# EasyEDA Pro project 一体板.epro, board PCB4
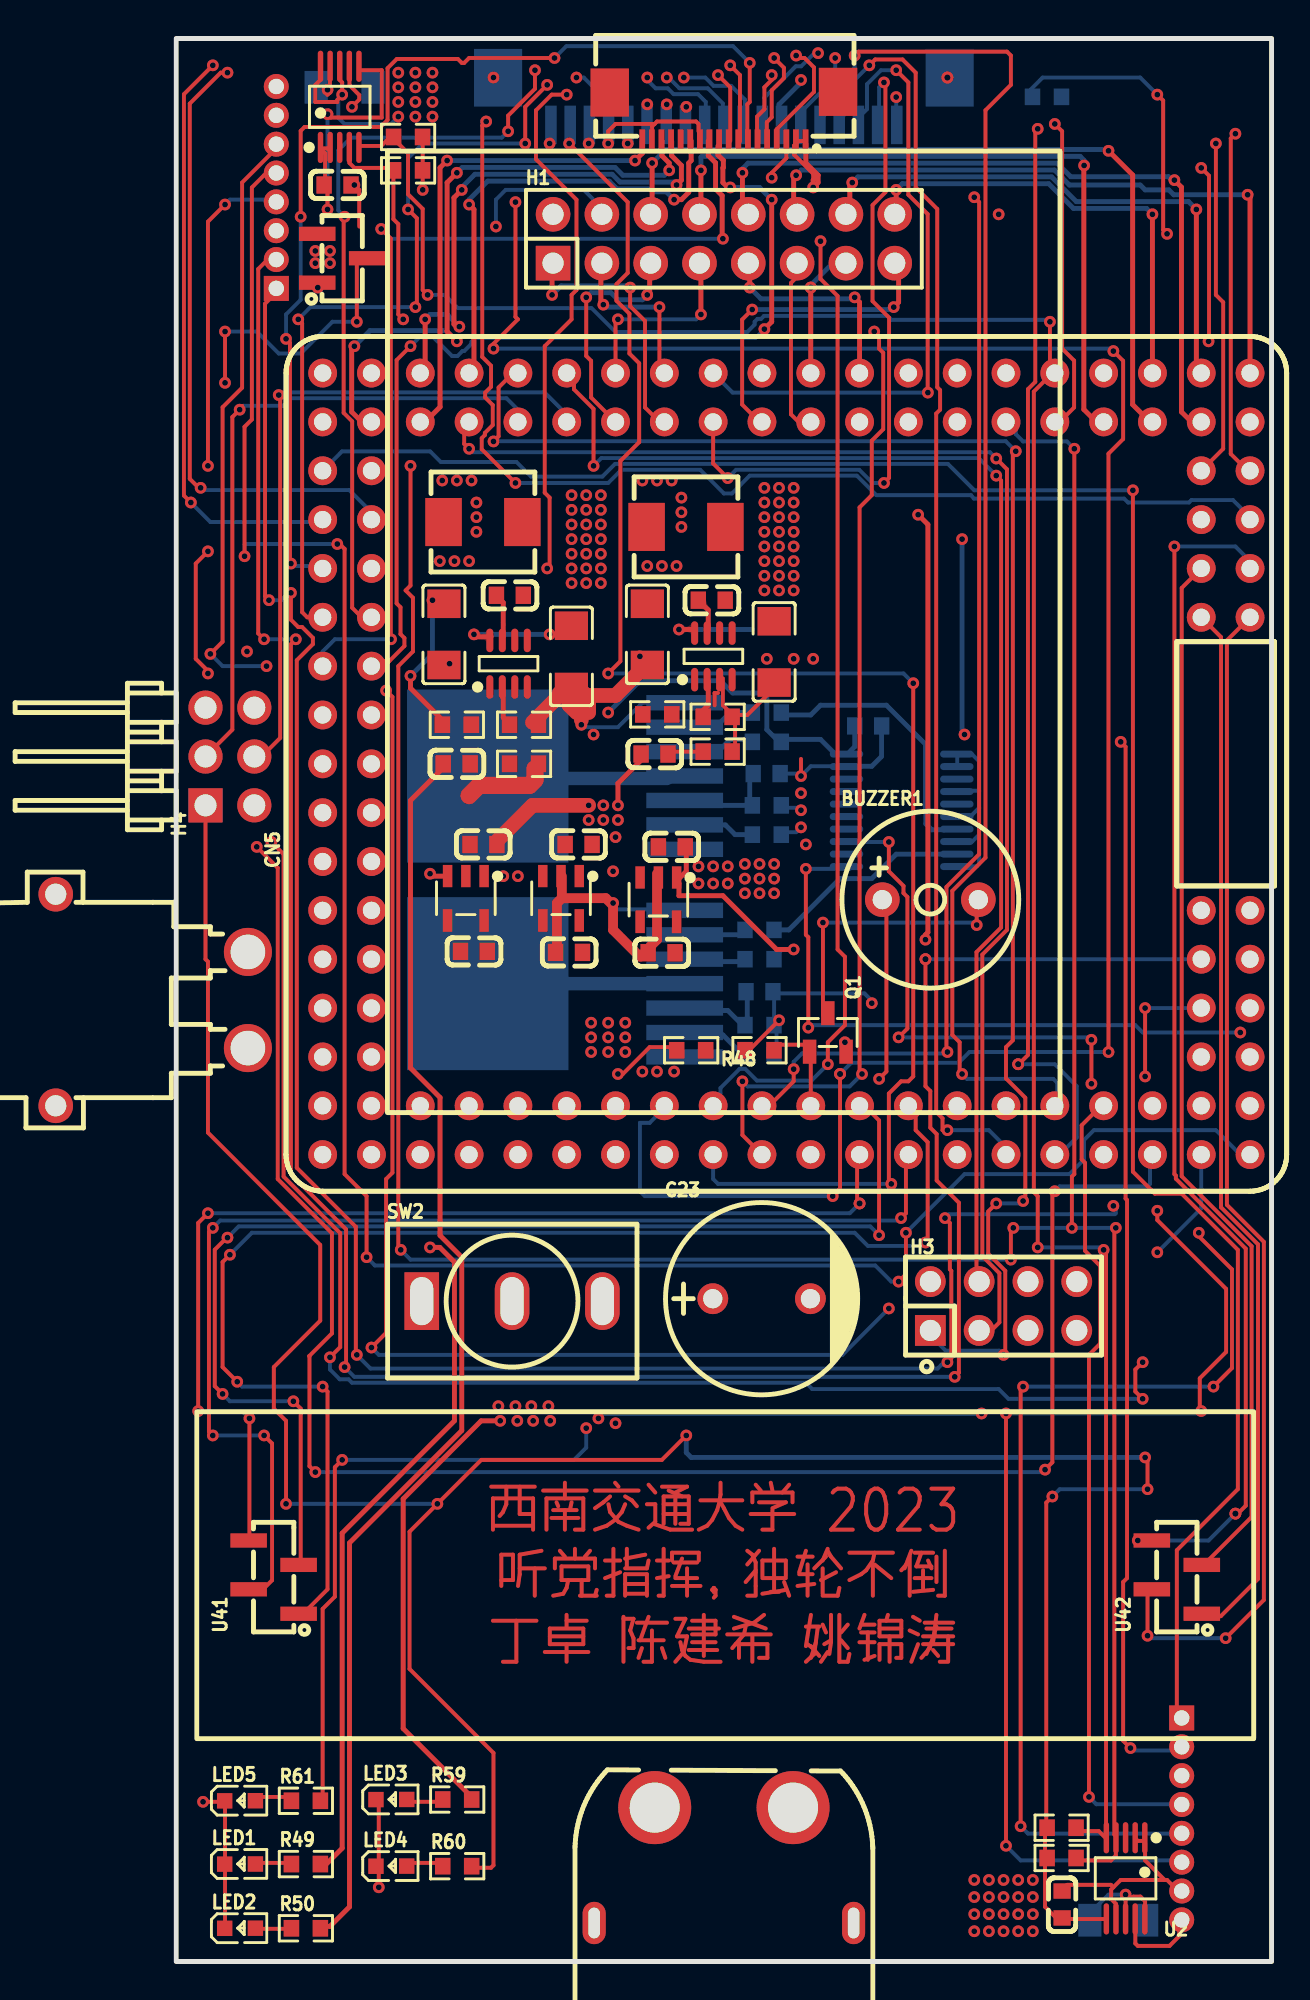
[diagram p11: board, top side]
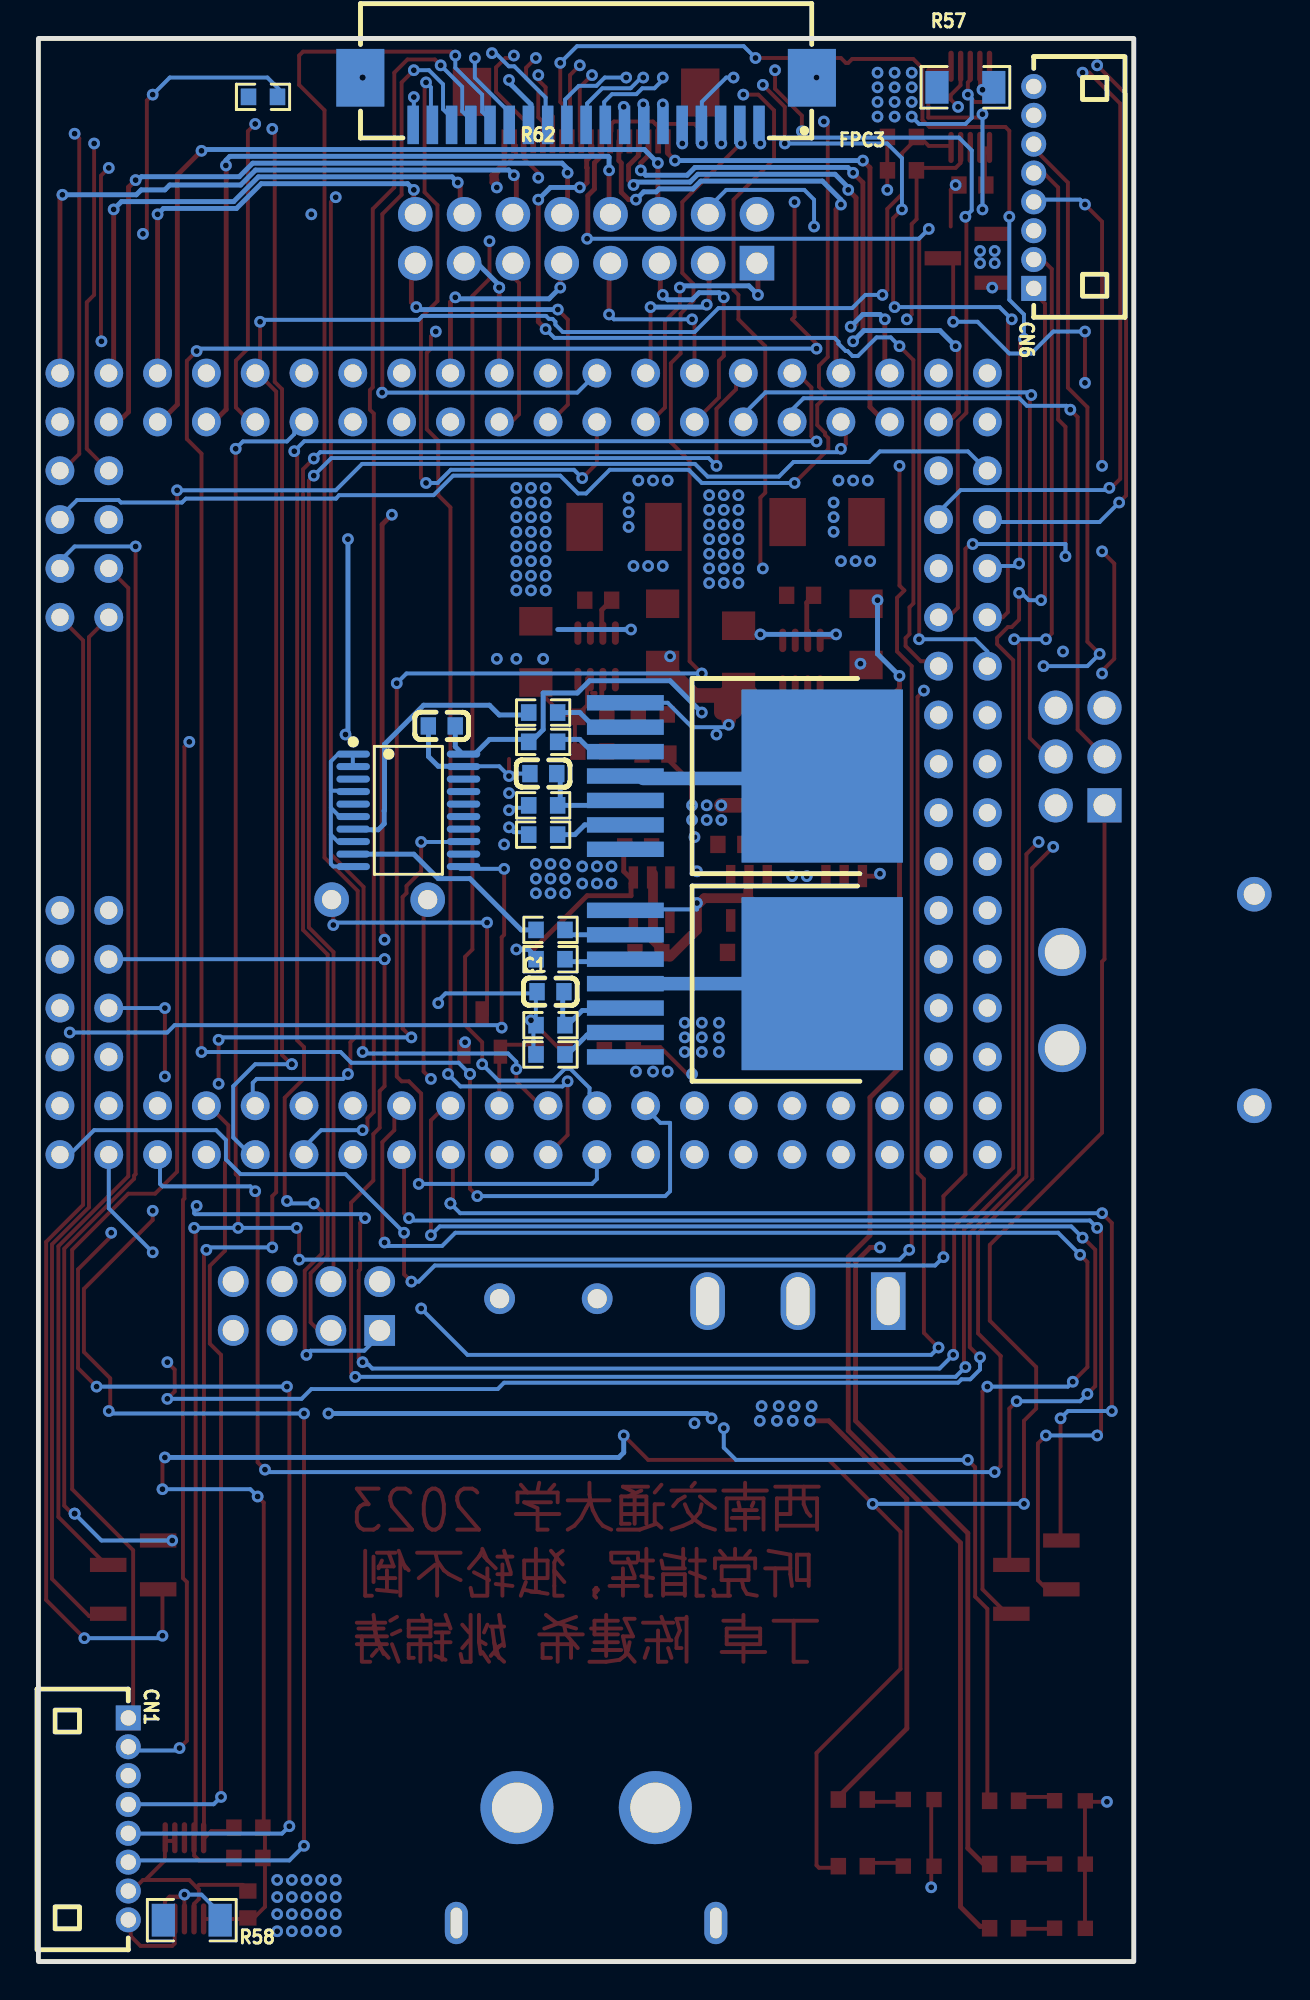
[diagram p12: board, bottom side, seen from below]

Outline 57 x 100 mm; copper layers: Top Layer, Inner1, Inner2, Bottom Layer. Coordinates in mm from the lower left corner of the outline.
Outline path: rectangle 0,100 57,0
Stack: Top Layer 0.035mm 外层铜厚1oz / Dielectric1 0.2104mm 7628 RC49% 8.6mil / Inner1 0.0152mm 内层铜厚 / Dielectric2 1.065mm 1.1mm H/HOZ 含铜 / Inner2 0.0152mm 内层铜厚 / Dielectric3 0.2104mm 7628 RC49% 8.6mil / Bottom Layer 0.035mm 外层铜厚1oz

## Design rules (mm)
template: 自定义配置
spacing copperThickness1oz (default): track to track 0.102, other pairs 0.152 to 0.3
spacing copperThickness2oz: track to track 0.203, other pairs 0.152 to 0.3
track width copperThickness1oz (default): min 0.127, default 0.254, max 2.54
track width copperThickness2oz: min 0.203, default 0.254, max 2.54
differential pair differentialPair (default): width min 0.127, default 0.254, max 2.54; gap min 0.152, default 0.152
via viaSize (default): diameter min 0.5, default 0.61, max 10; hole min 0.3, default 0.305, max 6.3

## Placement (name value [footprint] x y rotation side)
BUZZER1  3kHz  [BUZ-TH_BD9.0-P5.00-D0.6-FD]  39.24 55.22 0 top
C1  100nF  [C0603]  30.35 50.43 180 bottom
C2  100nF  [C0603]  30.73 61.77 180 bottom
C3  100nF  [C0603]  36.01 64.25 180 bottom
C7  1uF  [C0603]  15.99 58.09 0 top
C8  4.7uF  [C1206]  31.12 68.1 90 top
C9  12pF  [C0603]  24.89 62.79 180 top
C10  22uF  [C1206]  24.52 69.01 90 top
C11  10nF  [C0603]  27.87 70.79 180 top
C12  4.7uF  [C1206]  20.56 67.87 90 top
C13  12pF  [C0603]  14.6 62.28 180 top
C14  22uF  [C1206]  13.93 69.01 90 top
C15  10nF  [C0603]  17.36 71.04 180 top
C16  1uF  [C0603]  15.49 52.53 180 top
C17  1uF  [C0603]  25.79 57.96 0 top
C18  1uF  [C0603]  25.26 52.46 180 top
C19  1uF  [C0603]  20.94 58.09 0 top
C20  1uF  [C0603]  20.44 52.48 180 top
C21  100nF  [C0603]  46.1 2.97 90 top
C22  100nF  [C0603]  8.4 92.38 0 top
C23  220uF  [CAP-TH_BD10.0-P5.00-D1.0-FD]  30.46 34.47 0 top
CN1  HC-ZH1.5-8AW  [CONN-TH_8P-P1.50_HCTL_HC-ZH1.5-8AW]  52.32 7.42 270 bottom
CN5  XT30PW-M  [CONN-TH_XT30PW-M]  -1.27 50 270 top
CN6  HC-ZH1.5-8AW  [CONN-TH_8P-P1.50_HCTL_HC-ZH1.5-8AW]  5.21 92.25 90 bottom
CN8  -  [CONN-TH_XT60PW-M]  28.5 5 90 top
FPC3  X10B25L19T  [FPC-SMD_X10B25U19T]  28.5 96.73 0 bottom
FPC4  FPC-05F-18PH20  [FPC-SMD_18P-P0.50_FPC-05F-18PH20]  28.5 95.94 180 top
H1  2.54-2*8P母加长针3.8  [HDR-TH_16P-P2.54-V-F-R2-C8-S2.54-1]  28.5 89.59 0 top
H3  DS1023-2*4SF11  [HDR-TH_8P-P2.54-V-F-R2-C4-S2.54-1]  43.05 34.09 0 top
H4  A2541WR-2x3P  [HDR-TH_6P-P2.54-H-R2-C3-S2.54-W10.0_A2541WR]  2.79 62.66 90 top
L2  4.7uH  [IND-SMD_L5.4-W5.2_FXL0530]  26.53 74.6 180 top
L3  4.7uH  [IND-SMD_L5.4-W5.2_FXL0530]  15.96 74.85 180 top
LED1  KT-0603R  [LED0603-RD]  3.32 5.07 0 top
LED2  KT-0603R  [LED0603-RD]  3.32 1.73 0 top
LED3  KT-0603R  [LED0603-RD]  11.19 8.42 0 top
LED4  KT-0603R  [LED0603-RD]  11.19 4.96 0 top
LED5  KT-0603R  [LED0603-RD]  3.32 8.36 0 top
Q1  S9013-G  [SOT-23-3_L2.9-W1.3-P1.90-LS2.4-BR]  33.91 48.31 270 top
R1  10kΩ  [R0603]  30.35 53.64 0 bottom
R3  1kΩ  [R0603]  30.73 58.6 0 bottom
R4  0603WAF5100T5E  [R0603]  30.73 60.12 0 bottom
R5  10kΩ  [R0603]  30.73 63.42 0 bottom
R6  10kΩ  [R0603]  30.73 64.95 0 bottom
R28  10kΩ  [R0603]  30.35 47.39 180 top
R37  1kΩ  [R0603]  30.35 47.17 0 bottom
R38  0603WAF5100T5E  [R0603]  30.35 48.69 0 bottom
R39  10kΩ  [R0603]  30.35 52.12 0 bottom
R41  47kΩ  [R0603]  28.17 64.72 180 top
R42  15kΩ  [R0603]  28.17 62.92 180 top
R43  110kΩ  [R0603]  25.03 64.85 180 top
R45  47kΩ  [R0603]  18.1 64.31 180 top
R47  110kΩ  [R0603]  14.6 64.31 180 top
R48  10kΩ  [R0603]  26.8 47.39 180 top
R49  1kΩ  [R0603]  6.75 5.07 0 top
R50  1kΩ  [R0603]  6.75 1.73 0 top
R51  4.7kΩ  [R0603]  46.07 5.38 0 top
R52  4.7kΩ  [R0603]  46.07 6.96 0 top
R54  4.7kΩ  [R0603]  12.06 93.14 180 top
R55  4.7kΩ  [R0603]  12.06 94.88 180 top
R56  12kΩ  [R0603]  18.1 62.28 180 top
R57  16mΩ  [R1206]  8.76 97.46 180 bottom
R58  16mΩ  [R1206]  49.02 2.15 0 bottom
R59  1kΩ  [R0603]  14.62 8.42 0 top
R60  1kΩ  [R0603]  14.62 4.96 0 top
R61  1kΩ  [R0603]  6.75 8.36 0 top
R62  0Ω  [R0603]  45.31 96.96 0 bottom
SW2  MT-0-103-A101-M200-RS+PJ  [SW-TH_MT-0-103-A101-M200-RS]  17.48 34.34 0 top
U1  TC387核心板 COPY  [TC264逐飞]  26.67 62.92 90 top
U2  INA226AIDGSR  [MSOP-10_L3.0-W3.0-P0.50-LS5.0-BL]  49.4 4.33 180 top
U29  SN74HC244PWR  [TSSOP-20_L6.5-W4.4-P0.65-LS6.4-BL]  37.75 59.86 270 bottom
U30  BTN8982TA  [TO-263-7_L10.2-W10.4-P1.27-LS14.4-TL]  21.34 50.85 180 bottom
U31  BTN8982TA  [TO-263-7_L10.2-W10.4-P1.27-LS14.4-TL]  21.34 61.65 180 bottom
U35  SY8303AIC  [TSOT-23-8_L2.9-W1.6-P0.65-LS2.8-BR]  27.95 67.87 270 top
U36  SY8303AIC  [TSOT-23-8_L2.9-W1.6-P0.65-LS2.8-BR]  17.29 67.49 270 top
U37  RT9013-33GB  [SOT-23-5_L3.0-W1.7-P0.95-LS2.8-BL]  15.07 55.29 180 top
U38  RT9013-33GB  [SOT-23-5_L3.0-W1.7-P0.95-LS2.8-BL]  25.09 55.22 180 top
U39  RT9013-33GB  [SOT-23-5_L3.0-W1.7-P0.95-LS2.8-BL]  20.02 55.29 180 top
U40  INA226AIDGSR  [MSOP-10_L3.0-W3.0-P0.50-LS5.0-BL]  8.51 96.44 0 top
U41  X1311FVS-04-C43D35R2  [HDR-SMD_4P-P1.27-V-F-LS4.5_R2]  5.07 19.99 90 top
U42  X1311FVS-04-C43D35R2  [HDR-SMD_4P-P1.27-V-F-LS4.5_R2]  52.07 19.99 90 top
U44  X1311FVS-03-C43D35R1  [HDR-SMD_3P-P1.27-V-F_R1]  8.64 88.57 90 top

## Footprints (pads in the part's own frame, mm; a bottom-side part is the same pattern mirrored in y, then rotated)
BUZ-TH_BD9.0-P5.00-D0.6-FD
  round 1.801 hole 1.001: 1(-2.499,0) 2(2.499,0)
C0603
  rect 0.8x0.9 smd: 1(-0.7,0) 2(0.7,0)
C1206
  rect 1.485x1.728 smd: 1(-1.593,0) 2(1.593,0)
CAP-TH_BD10.0-P5.00-D1.0-FD
  round 1.6 hole 1: 1(-2.54,0) 2(2.54,0)
CONN-TH_8P-P1.50_HCTL_HC-ZH1.5-8AW
  rect 1.3x1.3 hole 0.8: 1(-5.25,0)
  round 1.3 hole 0.8: 2(-3.75,0) 3(-2.25,0) 4(-0.75,0) 5(0.75,0) 6(2.25,0) 7(3.75,0) 8(5.25,0)
CONN-TH_XT30PW-M
  round 2.5 hole 1.8: 1(-2.5,5) 2(2.5,5)
  round 1.8 hole 1.1: 3(5.5,-5) 4(-5.5,-5)
CONN-TH_XT60PW-M
  round 3.8 hole 2.6: 1(3,-3.6) 2(3,3.6)
  oval 2.2x1.2 hole 1.6x0.6: 3(-3,6.75) 4(-3,-6.75)
FPC-SMD_18P-P0.50_FPC-05F-18PH20
  rect 0.3x1.25 smd: 1(-4.25,1.288) 2(-3.75,1.288) 3(-3.25,1.288) 4(-2.75,1.288) 5(-2.25,1.288) 6(-1.75,1.288) 7(-1.25,1.288) 8(-0.75,1.288) 9(-0.25,1.288) 10(0.25,1.288) 11(0.75,1.288) 12(1.25,1.288) 13(1.75,1.288) 14(2.25,1.288) 15(2.75,1.288) 16(3.25,1.288) 17(3.75,1.288) 18(4.25,1.288)
  rect 2x2.5 smd: 19(-5.94,-1.288) 20(5.94,-1.252)
FPC-SMD_X10B25U19T
  rect 0.6x2 smd: 1(-9,1.225) 2(-8,1.225) 3(-7,1.225) 4(-6,1.225) 5(-5,1.225) 6(-4,1.225) 7(-3,1.225) 8(-2,1.225) 9(-1,1.225) 10(0,1.225) 11(1,1.225) 12(2,1.225) 13(3,1.225) 14(4,1.225) 15(5,1.225) 16(6,1.225) 17(7,1.225) 18(8,1.225) 19(9,1.225)
  rect 2.5x3 smd: 20(11.75,-1.225) 21(-11.75,-1.225)
HDR-SMD_3P-P1.27-V-F_R1
  rect 0.74x1.9 smd: 1(-1.27,1.3) 2(0,-1.3) 3(1.27,1.3)
HDR-SMD_4P-P1.27-V-F-LS4.5_R2
  rect 0.74x1.9 smd: 1(-1.905,-1.3) 2(-0.635,1.3) 3(0.635,-1.3) 4(1.905,1.3)
HDR-TH_6P-P2.54-H-R2-C3-S2.54-W10.0_A2541WR
  rect 1.778x1.778 hole 1.143: 1(-2.54,1.27)
  round 1.778 hole 1.143: 2(-2.54,-1.27) 3(0,1.27) 4(0,-1.27) 5(2.54,1.27) 6(2.54,-1.27)
HDR-TH_8P-P2.54-V-F-R2-C4-S2.54-1
  rect 1.6x1.6 hole 1.1: 1(-3.81,-1.27)
  round 1.6 hole 1.1: 2(-3.81,1.27) 3(-1.27,-1.27) 4(-1.27,1.27) 5(1.27,-1.27) 6(1.27,1.27) 7(3.81,-1.27) 8(3.81,1.27)
HDR-TH_16P-P2.54-V-F-R2-C8-S2.54-1
  rect 1.8x1.8 hole 1.1: 1(-8.89,-1.27)
  round 1.8 hole 1.1: 2(-8.89,1.27) 3(-6.35,-1.27) 4(-6.35,1.27) 5(-3.81,-1.27) 6(-3.81,1.27) 7(-1.27,-1.27) 8(-1.27,1.27) 9(1.27,-1.27) 10(1.27,1.27) 11(3.81,-1.27) 12(3.81,1.27) 13(6.35,-1.27) 14(6.35,1.27) 15(8.89,-1.27) 16(8.89,1.27)
IND-SMD_L5.4-W5.2_FXL0530
  rect 1.9x2.5 smd: 1(-2.05,0) 2(2.05,0)
LED0603-RD
  rect 0.8x0.8 smd: 1(-0.799,-0.004) 2(0.799,0.004)
MSOP-10_L3.0-W3.0-P0.50-LS5.0-BL
  oval 0.28x1.62 smd: 1(-1,-2.11) 2(-0.5,-2.11) 3(0,-2.11) 4(0.5,-2.11) 5(1,-2.11) 6(1,2.11) 7(0.5,2.11) 8(0,2.11) 9(-0.5,2.11) 10(-1,2.11)
R0603
  rect 0.806x0.864 smd: 1(-0.753,0) 2(0.753,0)
R1206
  rect 1.208x1.701 smd: 1(-1.479,0) 2(1.479,0)
SOT-23-3_L2.9-W1.3-P1.90-LS2.4-BR
  rect 1.25x0.7 smd: 1(1,-0.95) 2(1,0.95) 3(-1,0)
SOT-23-5_L3.0-W1.7-P0.95-LS2.8-BL
  rect 0.49x1.157 smd: 1(-0.95,-1.153) 2(0,-1.153) 3(0.95,-1.153)
  rect 0.49x1.175 smd: 4(0.95,1.153) 5(-0.95,1.153)
SW-TH_MT-0-103-A101-M200-RS
  rect 1.8x3 hole 1.2x2.5: 1(-4.7,0)
  oval 1.8x3 hole 1.2x2.5: 2(0,0) 3(4.7,0)
TC264逐飞
  round 1.5 hole 0.9: 1(-20.955,19.05) 2(-18.415,19.05) 3(-20.955,16.51) 4(-18.415,16.51) 5(-20.955,13.97) 6(-18.415,13.97) 7(-20.955,11.43) 8(-18.415,11.43) 9(-20.955,8.89) 10(-18.415,8.89) 11(-20.955,6.35) 12(-18.415,6.35) 13(-20.955,3.81) 14(-18.415,3.81) 15(-20.955,1.27) 16(-18.415,1.27) 17(-20.955,-1.27) 18(-18.415,-1.27) 19(-20.955,-3.81) 20(-18.415,-3.81) 21(-20.955,-6.35) 22(-18.415,-6.35) 23(-20.955,-8.89) 24(-18.415,-8.89) 25(-20.955,-11.43) 26(-18.415,-11.43) 27(-20.955,-13.97) 28(-18.415,-13.97) 29(-20.955,-16.51) 30(-18.415,-16.51) 31(-20.955,-19.05) 32(-18.415,-19.05) 33(-20.955,-21.59) 34(-18.415,-21.59) 35(-20.955,-24.13) 36(-18.415,-24.13) 37(-20.955,-26.67) 38(-18.415,-26.67) 39(-20.955,-29.21) 40(-18.415,-29.21) 41(-15.875,-29.21) 42(-15.875,-26.67) 43(-13.335,-29.21) 44(-13.335,-26.67) 45(-10.795,-29.21) 46(-10.795,-26.67) 47(-8.255,-29.21) 48(-8.255,-26.67) 49(6.985,-26.67) 50(6.985,-29.21) 51(9.525,-26.67) 52(9.525,-29.21) 53(12.065,-26.67) 54(12.065,-29.21) 55(14.605,-26.67) 56(14.605,-29.21) 57(17.145,-29.21) 58(19.685,-29.21) 59(17.145,-26.67) 60(19.685,-26.67) 61(17.145,-24.13) 62(19.685,-24.13) 63(17.145,-21.59) 64(19.685,-21.59) 65(17.145,-19.05) 66(19.685,-19.05) 67(17.145,-16.51) 68(19.685,-16.51) 69(17.145,-13.97) 70(19.685,-13.97) 71(17.145,-11.43) 72(19.685,-11.43) 73(17.145,-8.89) 74(19.685,-8.89) 75(17.145,-6.35) 76(19.685,-6.35) 77(17.145,-3.81) 78(19.685,-3.81) 79(17.145,-1.27) 80(19.685,-1.27) 81(17.145,1.27) 82(19.685,1.27) 83(17.145,3.81) 84(19.685,3.81) 85(17.145,6.35) 86(19.685,6.35) 87(17.145,8.89) 88(19.685,8.89) 89(17.145,11.43) 90(19.685,11.43) 91(17.145,13.97) 92(19.685,13.97) 93(17.145,16.51) 94(19.685,16.51) 95(17.145,19.05) 96(19.685,19.05) 97(14.605,16.51) 98(14.605,19.05) 99(12.065,16.51) 100(12.065,19.05) 101(9.525,16.51) 102(9.525,19.05) 103(6.985,16.51) 104(6.985,19.05) 105(4.445,16.51) 106(4.445,19.05) 107(1.905,16.51) 108(1.905,19.05) 109(-0.635,16.51) 110(-0.635,19.05) 111(-3.175,16.51) 112(-3.175,19.05) 113(-5.715,16.51) 114(-5.715,19.05) 115(-8.255,16.51) 116(-8.255,19.05) 117(-10.795,16.51) 118(-10.795,19.05) 119(-13.335,16.51) 120(-13.335,19.05) 121(-15.875,16.51) 122(-15.875,19.05)
TO-263-7_L10.2-W10.4-P1.27-LS14.4-TL
  rect 4x0.8 smd: 1(-5.122,3.81) 2(-5.122,2.54) 3(-5.122,1.27) 4(-5.122,0) 5(-5.122,-1.27) 6(-5.122,-2.54) 7(-5.122,-3.81)
  rect 8.4x9 smd: 8(5.122,0)
TSOT-23-8_L2.9-W1.6-P0.65-LS2.8-BR
  oval 1.222x0.364 smd: 1(1.211,-0.975) 2(1.211,-0.325) 3(1.211,0.325) 4(1.211,0.975) 5(-1.211,0.975) 6(-1.211,0.325) 7(-1.211,-0.325) 8(-1.211,-0.975)
TSSOP-20_L6.5-W4.4-P0.65-LS6.4-BL
  oval 0.364x1.742 smd: 1(-2.925,-2.871) 2(-2.275,-2.871) 3(-1.625,-2.871) 4(-0.975,-2.871) 5(-0.325,-2.871) 6(0.325,-2.871) 7(0.975,-2.871) 8(1.625,-2.871) 9(2.275,-2.871) 10(2.925,-2.871) 11(2.925,2.871) 12(2.275,2.871) 13(1.625,2.871) 14(0.975,2.871) 15(0.325,2.871) 16(-0.325,2.871) 17(-0.975,2.871) 18(-1.625,2.871) 19(-2.275,2.871) 20(-2.925,2.871)

## Nets
As in the schematic.

Pads without a net: CN5 3 4; FPC4 14 19 20; H3 2 8; H4 5 6; U1 5 6 7 8 9 10 11 12 13 14 15 21 27 30 41 42 43 45 47 48 53 64 68 69 70 71 72 73 78 94 95 96 97 107 109 110 111 112 113 114 115 116 117 118 119 120 121 122; U2 3; U29 3 5 12 14 15 16 17 18; U37 4; U38 4; U39 4; U40 3

## Via types
v1: diameter 0.61, hole 0.305, Top Layer to Bottom Layer, 442 vias

## Routing (per net, layer and track width the routed paths; a pad name or vN(x,y) marks a point on that pad's centre or on a via; arc(x,y) is an arc through that point)
3.3V_LDO_CAMERA: length 122.6
  Top Layer w0.203: 32.38,94.67 32.15,94.44 32.15,93.96 33.15,92.96 33.15,92.63 ; 32.38,94.67 32.26,94.67 ; 32.38,94.67 32.77,94.67
  Top Layer w0.254: v1(16.86,28.12) 15.87,28.12 11.81,24.06 11.81,12.12 15.37,8.56 ; 32.77,94.54 32.77,93.52 33.4,92.89 ; 33.4,92.89 33.4,92.51 v1(33.15,92.25) 33.15,92.63 33.4,92.89 ; v1(38.61,75.23) 39.12,74.73 39.12,53.52 38.99,53.39 38.99,53.26 38.86,53.14 v1(38.99,53.14)
  Inner1 w0.254: v1(38.61,75.23) 38.61,75.74 39.24,76.38 39.24,80.31 39.75,80.82 39.75,81.84 39.5,82.09 39.5,82.83 36.43,85.9 36.07,85.9 36.07,89.2 35.69,89.59 34.42,89.59 33.81,90.2 33.53,90.2 33.53,91.87 v1(33.15,92.25)
  Inner2 w0.254: v1(16.76,28.88) 16.26,29.39 16.26,35.61 16.51,35.86 16.51,44.25 16.38,44.37 16.38,53.77 16.89,54.28 29.59,54.28 30.48,53.39 38.74,53.39 v1(38.99,53.14)
  vias: v1(17.65,28.88) v1(17.75,28.12) v1(18.48,28.88) v1(18.57,28.12) v1(19.37,28.88) v1(19.46,28.12)
3.3V_LDO_ELE: length 134.7
  Top Layer w0.203: 7.62,8.31 7.62,18.34 8.25,18.97 8.25,25.71 v1(8.64,26.09)
  Inner1 w0.254: v1(41.02,63.81) 40.39,63.17 40.39,51.23 41.91,49.71 41.91,38.02 40.64,36.75 40.64,31.8 41.91,30.53 v1(41.91,28.5) ; v1(42.8,90.86) 42.8,84 42.04,83.24 42.04,75.11 v1(40.89,73.97)
  Inner2 w0.254: v1(32.51,97.84) 35.31,97.84 37.08,96.06 40.89,96.06 42.8,94.16 v1(42.8,90.86)
  Bottom Layer w0.203: v1(8.64,26.09) 20.7,26.09 21.34,26.72 v1(21.34,27.74)
  Bottom Layer w0.254: v1(32.51,97.84) 32.38,97.71 32.38,97.59 31.37,96.57 31.37,96.06 ; v1(41.91,28.5) 22.22,28.5 v1(21.97,28.25) ; v1(41.02,63.81) 40.89,63.93 v1(40.89,73.97)
  vias: v1(22.86,27.99)
3.3V_LDO_ENCODER: length 273.4
  Top Layer w0.203: 9.53,98.35 10.69,98.35 10.69,95.89 8.05,95.89 v1(7.87,96.06) ; 1.52,60.25 1.52,52.12 1.65,51.99 1.65,43.1 7.49,37.26 7.49,33.33 5.08,30.91 5.08,28.75 5.72,28.12 v1(5.72,23.8) ; v1(45.59,24.18) 45.28,23.86 45.28,6.72 ; 8,94.16 7.87,94.28 7.49,94.28 7.75,94.03 7.75,92.51 ; 45.28,6.72 45.21,6.66 45.21,2.84 45.85,2.21 ; 45.28,6.72 45.34,6.78 ; v1(26.54,27.36) 25.27,26.09 15.88,26.09 v1(13.59,23.8) 12.14,22.35 12.14,15.22 16.51,10.85 16.51,5 16.38,4.88 15.37,4.88 ; 48.39,2.21 46.23,2.21 ; 7.75,92.38 7.87,92.25 v1(7.87,91.11) ; 12.83,93.02 v1(12.83,92.13) ; 12.83,94.92 12.83,93.14 ; v1(50.55,24.56) 50.55,26.09 v1(50.42,26.21)
  Inner1 w0.203: v1(12.83,92.13) 12.37,91.67 8.43,91.67 v1(7.87,91.11)
  Inner2 w0.203: v1(12.83,92.13) 13.21,92.13 15.11,90.22 v1(16.64,90.22)
  Inner2 w0.254: v1(50.42,26.21) 49.28,27.36 49.28,35.48 50.29,36.5 50.29,39.29 52.2,41.2 52.2,45.14 52.07,45.14 51.31,45.9 51.31,76.63 49.4,78.54 49.4,80.82 48.9,81.33 42.67,81.33 41.91,80.57 41.91,79.3 41.53,78.92 26.92,78.92 26.67,79.17 26.67,84 25.91,84.76 25.91,89.33 25.65,89.59 23.62,89.59 22.48,90.73
  Bottom Layer w0.203: 21.84,91.36 21.84,91.49 21.21,92.13 17.15,92.13 16.64,91.62 v1(16.64,90.22) ; v1(12.83,92.13) 12.83,92 ; v1(50.55,24.56) 45.97,24.56 v1(45.59,24.18) ; 13.72,23.8 v1(5.72,23.8) ; v1(7.87,96.06) v1(7.87,91.11)
  Bottom Layer w0.254: v1(26.54,27.36) 26.54,26.47 26.8,26.21 v1(50.42,26.21)
5V_DCDC: length 267.9
  Top Layer w0.254: v1(32.13,52.63) 31.24,52.63 28.45,55.42 26.16,55.42 26.16,56.06 26.03,56.19 26.54,56.69 26.54,57.96 ; v1(13.21,56.57) 13.34,56.44 14.22,56.44 ; v1(22.99,60.12) 22.99,61.27 24.26,62.53 ; v1(13.21,37.14) 13.72,37.14 14.48,36.37 14.48,28.12 8.64,22.28 8.64,5.89 7.62,4.88
  Top Layer w0.762: v1(21.46,60.12) 18.54,60.12 16.76,58.34
  Inner1 w0.762: 22.35,59.74 12.57,59.74 11.81,58.98 11.81,45.77 10.41,44.37 ; v1(21.46,59.36) v1(22.22,59.36) v1(22.99,59.36) v1(22.99,60.12) v1(22.22,60.12) v1(21.46,60.12) ; 10.03,44.5 7.87,44.5
  Inner2 w0.254: 5.08,89.84 9.53,89.84 10.03,89.33 17.4,89.33 18.29,88.44 18.29,84.25 19.05,83.49 19.05,76.76 20.05,75.75 ; v1(21.46,94.54) 21.46,93.27 20.83,92.63 20.83,86.92 20.57,86.67 20.57,84.51 21.59,83.49 21.59,79.88 24.26,77.21 v1(24.26,77.01) ; 14.22,59.49 14.1,59.36 12.4,59.36 12.4,57.38 v1(13.21,56.57) ; 52.45,9.7 48.39,9.7 46.61,11.48 46.61,32.31 46.99,32.69 ; 10.54,44.5 11.43,43.61 11.43,40.56 13.21,38.79 v1(13.21,37.14)
  Inner2 w0.635: 44.45,45.26 44.45,40.44 44.83,40.06 44.83,39.8 45.72,38.91 45.72,35.99 45.59,35.86 45.59,33.71 46.48,32.82
  Inner2 w0.762: 44.45,45.26 44.45,45.77 45.47,46.79 47.75,46.79 48.39,46.15 49.15,46.15 49.66,46.66 49.66,47.55 49.28,47.93 49.28,50.47 50.04,51.23 50.04,74.73 48.64,76.12 40.89,76.12 38.86,78.16 26.92,78.16 v1(25.78,77.01)
  Bottom Layer w0.254: 35.05,62.92 35.31,63.17 35.31,64.31 ; 31.62,63.55 33.53,63.55 34.29,62.79 ; 31.12,52.25 31.5,52.63 v1(32.13,52.63) ; 31.5,63.3 30.73,64.06 30.73,65.96 28.96,65.96 28.32,66.6 24.13,66.6 v1(22.48,64.95)
  vias: v1(17.02,56.44) v1(17.78,56.44) v1(22.73,56.69) v1(22.86,58.47) v1(24.51,72.57) v1(25.02,77.01) v1(25.27,72.57) v1(26.03,72.57) v1(26.29,76.12) v1(26.29,75.36) v1(26.29,74.6)
6.1V_DCDC: length 72.8
  Top Layer w0.254: 13.59,70.66 13.46,70.66 v1(13.34,70.79) ; v1(12.19,66.85) 12.19,66.22 13.84,64.57 ; 13.84,62.03 12.19,60.38 12.19,46.47 13.73,44.93 13.73,37.76 14.86,36.63 14.86,27.61 9.02,21.77 9.02,2.84 8,1.83 7.75,1.83
  Bottom Layer w0.254: v1(13.34,70.79) 13.34,68 v1(12.19,66.85)
  vias: v1(7.24,88.95) v1(7.24,88.32) v1(8,88.95) v1(8,88.32) v1(13.72,72.82) v1(13.84,77.01) v1(14.48,72.82) v1(14.6,77.01) v1(15.24,72.82) v1(15.37,77.01) v1(15.62,75.87) v1(15.62,75.11) v1(15.62,74.35)
GND: length 129.4
  Top Layer w0.203: 29.08,64.82 29.72,64.82 31.24,66.34 ; 51.44,4.24 50.42,5.26 50.42,6.15 ; 51.44,4.24 49.15,4.24 48.77,3.86 ; 51.44,4.24 51.56,4.24 51.82,3.99 ; 27.18,95.17 27.18,95.56 27.05,95.68 25.02,95.68 24.89,95.56 ; 28.02,65.32 28.02,65.96 28.19,65.96 ; 24.89,95.56 22.86,95.56 22.48,95.17 v1(22.48,94.54) ; 24.89,95.56 24.76,95.43 24.76,94.79 ; 29.08,64.69 29.08,63.04 28.96,62.92 ; 2.54,8.43 2.54,8.31 ; 2.54,8.31 v1(1.4,8.31) ; 2.54,8.31 2.54,1.45 ; 28.45,66.73 28.45,65.33 28.96,64.82 ; 9.02,98.48 9.02,97.56 9.53,97.06 9.53,96.83 v1(9.14,96.44) ; 29.84,47.42 v1(31.37,48.95) ; 50.42,6.27 50.04,6.27 49.91,6.4 ; v1(10.54,3.86) 10.54,4.75 10.41,4.88 10.54,5 10.54,8.31 ; 46.35,3.99 48.64,3.99 48.77,3.86 ; 48.9,2.34 48.9,3.01 48.65,3.25 48.65,3.75 48.77,3.86 ; v1(30.99,92.76) 30.99,93.02 31.75,93.78 31.75,94.54 ; v1(32.51,61.65) 32.51,62.53 ; 9.53,90.22 9.53,92.13 v1(9.27,92.38)
  Top Layer w0.508: 20.07,55.3 20.07,56.44 ; 20.07,55.3 22.35,55.3 22.73,54.92 22.73,53.64 24.13,52.25 ; 20.07,55.3 19.81,55.04 19.81,52.63 ; 25.02,56.57 25.02,53.14 24.38,52.5
  Top Layer w0.762: 24.38,67.11 24.13,67.11 22.86,65.84 21.34,65.84 ; 20.45,66.09 20.45,65.33 20.83,64.95 ; 21.34,65.84 21.46,65.71 21.46,64.95 ; 21.34,65.84 21.21,65.96 ; 19.94,65.96 19.94,65.84 18.54,64.44 ; 20.83,65.84 21.08,65.58 21.08,64.57
  Top Layer w0.889: 18.67,62.03 18.67,61.45 18.38,61.16 15.77,61.16 15.24,60.63
  Inner1 w0.203: v1(36.19,49.83) 36.19,49.07 34.93,47.8 v1(34.8,47.8) ; v1(20.83,97.97) 20.96,97.84 20.96,96.57 20.57,96.19 18.16,96.19 16.51,97.84 v1(16.51,97.97) ; v1(9.27,92.38) 9.27,92.25
  Inner2 w0.203: v1(9.14,96.44) 9.14,92.51 v1(9.27,92.38)
  Bottom Layer w0.203: 27.18,65.46 24.26,65.46 22.99,64.19 21.21,64.19 v1(21.08,64.31) ; 31.24,47.17 31.24,48.82 ; v1(20.83,97.97) 21.21,97.97 22.48,96.7 22.48,95.43 ; 41.78,60 41.78,58.6 ; 41.78,60 41.78,60.88 ; 41.78,60 41.28,59.49 ; 41.78,58.6 41.78,57.07 41.66,56.95 41.4,56.95 ; 41.78,58.6 41.4,58.22 ; 31.12,50.34 35.81,50.34 36.19,49.96 v1(36.19,49.83) ; 25.78,54.92 25.58,54.71 22.73,54.71 22.73,55.17 ; 30.99,50.22 31.12,50.09 31.12,48.56 ; 41.78,60.88 41.78,62.41 41.4,62.79 40.64,62.79 ; 41.78,60.88 41.4,60.88 ; 40.64,62.15 40.64,62.66 ; v1(32.51,58.98) 32.26,58.72 31.62,58.72 ; 31.5,60 32.38,60 v1(32.51,59.87) ; v1(31.37,48.95) 31.5,48.95 ; 34.8,62.15 33.02,62.15 v1(32.51,61.65) 32.38,61.77 31.75,61.77
  Bottom Layer w0.254: 35.18,62.15 36.19,62.15 36.7,62.66 36.7,64.06
  vias: v1(7.37,87.05) v1(14.22,67.49) v1(21.72,63.81) v1(22.73,55.04) v1(24.13,67.87) v1(30.73,67.74) v1(32.13,67.74) v1(32.51,60.76) v1(32.77,58.09) v1(33.15,67.74) v1(40.13,97.97) v1(40.13,97.97)
VCC_BAT: length 22.4
  Top Layer w0.203: 49.53,3.35 v1(49.4,3.48) ; 49.53,3.35 49.4,3.23 49.4,2.84 ; 49.53,3.35 49.78,3.35 49.81,3.38 50.18,3.38 50.42,3.13 50.42,2.46 ; 8.51,97.84 8.64,97.71 8.64,97.06 8.38,96.8 8.38,96.7 7.24,96.7 7.24,97.59 7.49,97.84
  Top Layer w0.254: 16.38,68.89 15.62,68.89 v1(15.49,69.01) ; 26.92,69.27 v1(26.16,69.27)
  Bottom Layer w0.203: 47.62,2.59 48.51,3.48 v1(49.4,3.48) ; v1(11.56,95.94) 11.18,95.56 8.76,95.56 8.43,95.88 8.43,96.88 v1(8.64,97.08)
  Bottom Layer w0.254: v1(26.16,69.27) 29.97,69.27 ; v1(15.49,69.01) v1(19.43,69.01)
  vias: v1(11.56,98.22) v1(11.56,97.46) v1(11.56,96.7) v1(12.45,98.22) v1(12.45,97.46) v1(12.45,96.7) v1(12.45,95.94) v1(13.34,98.22) v1(13.34,97.46) v1(13.34,96.7) v1(13.34,95.94) v1(20.57,76.25) v1(20.57,75.49) v1(20.57,74.73) v1(20.57,73.97) v1(20.57,73.2) v1(20.57,72.44) v1(20.57,71.68) v1(21.34,76.25) v1(21.34,75.49) v1(21.34,74.73) v1(21.34,73.97) v1(21.34,73.2) v1(21.34,72.44) v1(21.34,71.68) v1(21.59,48.82) v1(21.59,48.06) v1(21.59,47.3) v1(22.1,76.25) v1(22.1,75.49) v1(22.1,74.73) v1(22.1,73.97) v1(22.1,73.2) v1(22.1,72.44) v1(22.1,71.68) v1(22.48,48.82) v1(22.48,48.06) v1(22.48,47.3) v1(23.37,48.82) v1(23.37,48.06) v1(23.37,47.3) v1(24.26,46.28) v1(25.02,46.28) v1(25.91,46.28) v1(27.18,56.95) v1(27.18,56.06) v1(27.94,56.95) v1(27.94,56.06) v1(28.7,56.95) v1(28.7,56.06) v1(29.59,57.07) v1(29.59,56.31) v1(29.59,55.55) v1(30.35,57.07) v1(30.35,56.31) v1(30.35,55.55) v1(30.61,76.63) v1(30.61,75.87) v1(30.61,75.11) v1(30.61,74.35) v1(30.61,73.58) v1(30.61,72.82) v1(30.61,72.06) v1(30.61,71.3) v1(31.12,57.07) v1(31.12,56.31) v1(31.12,55.55) v1(31.37,76.63) v1(31.37,75.87) v1(31.37,75.11) v1(31.37,74.35) v1(31.37,73.58) v1(31.37,72.82) v1(31.37,72.06) v1(31.37,71.3) v1(32.13,76.63) v1(32.13,75.87) v1(32.13,75.11) v1(32.13,74.35) v1(32.13,73.58) v1(32.13,72.82) v1(32.13,72.06) v1(32.13,71.3) v1(41.53,4.24) v1(41.53,3.35) v1(41.53,2.46) v1(41.53,1.57) v1(42.29,4.24) v1(42.29,3.35) v1(42.29,2.46) v1(42.29,1.57) v1(43.05,4.24) v1(43.05,3.35) v1(43.05,2.46) v1(43.05,1.57) v1(43.81,4.24) v1(43.81,3.35) v1(43.81,2.46) v1(43.81,1.57) v1(44.58,4.24) v1(44.58,3.35) v1(44.58,2.46) v1(44.58,1.57)
10.2: length 69.2
  Top Layer w0.203: v1(21.72,77.78) 21.72,80.74 20.7,81.75 20.7,82.47 ; v1(42.67,77.27) 42.93,77.01 42.93,53.77 41.64,52.49 41.64,35.88 42.04,35.48
  Bottom Layer w0.203: v1(42.67,77.27) 41.76,78.18 22.12,78.18 v1(21.72,77.78)
10.5: length 85.1
  Top Layer w0.203: v1(43.05,31.55) 43.14,31.64 43.14,35.92 42.25,36.81 42.25,39 v1(42.67,39.42) ; 17.4,82.47 16.78,81.85 16.78,79.31 v1(16.51,79.05) ; v1(43.69,78.54) 43.54,78.39 43.54,47.91 43.18,47.55 43.18,45.92 44.18,44.92 44.18,39.66 v1(44.07,39.55)
  Bottom Layer w0.203: v1(16.51,79.05) 16.52,79.06 43.17,79.06 v1(43.69,78.54) ; 39.24,32.69 39.24,32.56 40.04,31.76 42.84,31.76 v1(43.05,31.55) ; v1(42.67,39.42) 43.94,39.42 v1(44.07,39.55)
10.6: length 76.1
  Top Layer w0.203: v1(42.67,78.16) 43.23,77.6 43.23,53.65 41.95,52.36 41.95,36.68 42.84,35.79 42.84,33.24 42.16,32.56 ; v1(15.24,78.66) 14.99,78.92 14.99,80.06
  Bottom Layer w0.203: v1(15.24,78.66) 15.42,78.49 42.34,78.49 v1(42.67,78.16)
20.11: length 74.2
  Top Layer w0.203: v1(16.13,95.68) 15.93,95.48 15.93,83.44 16.38,82.98 16.38,81.89 16.08,81.58 16.08,81.33 16.47,80.94 16.47,79.89 16.06,79.49 16.06,79.38 15.9,79.22 15.9,78.64 v1(17.65,76.89)
  Inner2 w0.203: v1(16.13,95.68) 16.13,96.06 16.51,96.44 20.7,96.44 22.22,97.97 v1(24.51,97.97)
  Bottom Layer w0.203: v1(24.51,97.97) 24.51,97.84 24.94,97.41 25.58,97.41 25.88,97.1 27.15,97.1 27.56,96.7 27.56,95.94 ; v1(17.65,76.89) 22.48,76.89 23.16,77.57 27.27,77.57 28.5,76.34 28.92,76.34 29.84,77.27 35.42,77.27 36.43,76.25 41.36,76.25 41.51,76.07 49.33,76.07 49.53,75.87 52.71,75.87 52.83,76 54.99,76 55.5,75.49
20.12: length 51.5
  Top Layer w0.203: 53.72,77.9 54.48,78.66 54.48,86.28 54.1,86.67 v1(54.1,94.54)
  Inner1 w0.203: v1(54.1,94.54) 53.65,95 48.26,95 47.62,94.36 44.2,94.36 43.13,95.43 35.81,95.43 34.16,97.08 27.31,97.08 v1(26.42,97.97)
  Bottom Layer w0.203: 29.59,95.68 29.59,96.83 28.88,97.54 27.96,97.54 27.53,97.97 v1(26.42,97.97)
20.13: length 47.5
  Top Layer w0.203: v1(55.12,95.05) 54.88,94.81 54.88,78.4 55.75,77.52
  Inner1 w0.203: v1(33.4,99.24) 33.4,98.6 36.19,95.81 43.18,95.81 44.32,94.67 47.5,94.67 48.13,95.3 54.86,95.3 v1(55.12,95.05)
  Bottom Layer w0.203: 30.61,95.56 30.61,96.92 32.24,98.55 32.52,98.55 33.21,99.24 v1(33.4,99.24)
20.14: length 48.1
  Top Layer w0.203: 53.75,84.25 53.75,92.86 v1(53.34,93.27)
  Inner1 w0.203: 55.63,80.06 54.61,81.08 54.61,83.36 v1(53.72,84.25) ; v1(25.53,97.97) 26.42,97.08 26.87,97.08 27.18,96.77 34.04,96.77 35.69,95.12 43,95.12 44.07,94.06 47.6,94.06 48.39,93.27 v1(53.34,93.27)
  Bottom Layer w0.203: 28.45,95.94 28.45,96.62 27.66,97.41 26.18,97.41 25.63,97.97 v1(25.53,97.97)
A1: length 77.3
  Top Layer w0.203: v1(41.53,91.75) 41.78,91.49 41.78,57.58 40.08,55.88 40.08,47.37 40,47.3 ; U1.20 30.48,44.37 30.61,44.25 32.13,45.77 v1(32.13,46.41)
  Inner2 w0.203: v1(25.53,96.57) 26.16,97.21 26.92,97.21 27.56,96.57 35.94,96.57 37.47,95.05 41.33,95.05 41.53,94.84 v1(41.53,91.75)
  Bottom Layer w0.203: v1(40.13,47.3) 40.06,47.22 32.56,47.22 32.13,46.79 v1(32.13,46.41)
A2: length 72.8
  Top Layer w0.203: v1(29.46,45.77) 29.46,42.98 30.23,42.22 ; v1(36.32,84.76) 36.58,84.51 36.58,83.87 36.79,83.66 36.79,79.68 36.19,79.08 36.19,76.25 35.56,75.62 35.56,46.28 v1(35.69,46.15)
  Inner2 w0.203: v1(36.32,84.76) 36.19,84.89 36.19,95.43 35.69,95.94 35.56,95.81 25.27,95.81 v1(24.51,96.57)
  Bottom Layer w0.203: v1(29.46,45.77) 29.73,45.5 35.04,45.5 v1(35.69,46.15)
A3: length 67.2
  Top Layer w0.203: v1(33.53,89.46) 33.53,87.5 34.42,86.61 34.42,52.63 34.8,52.25 34.8,48.69 33.91,47.8 v1(33.91,46.66)
  Inner2 w0.203: v1(23.5,94.54) 24.38,95.43 33.27,95.43 33.78,94.92 33.78,91.49 33.53,91.24 v1(33.53,89.46)
  Bottom Layer w0.203: 28.19,45.01 28.32,45.14 28.32,45.42 29.32,46.42 29.61,46.42 30.22,45.81 33.06,45.81 v1(33.91,46.66)
A4: length 84.2
  Top Layer w0.203: v1(38.35,66.47) 38.35,46.02 38.1,45.77 37.72,45.77 37.08,45.14 37.08,40.56 v1(37.21,40.44) ; v1(22.48,66.98) 23.11,67.61 23.11,78.03 24.09,79.01 24.09,83.11 23.58,83.62 23.58,85.69 22.91,86.36 22.91,87.22 23.5,87.81 23.5,91.49 v1(20.45,94.54)
  Bottom Layer w0.203: v1(37.21,40.44) 28.19,40.44 27.94,40.69 27.94,42.34 ; v1(38.35,66.47) 37.85,66.98 v1(22.48,66.98)
A5: length 117.5
  Top Layer w0.203: v1(34.16,39.8) 34.54,40.18 v1(34.54,46.15) ; v1(48.51,47.3) 48.51,78.41 49.28,79.17 49.28,83.24 v1(48.77,83.74) ; v1(17.65,91.49) 17.65,85.52 17.78,85.39 16.51,84.12 v1(16.51,83.87)
  Inner2 w0.203: v1(17.65,91.49) 17.65,91.62 19.43,93.4 v1(19.43,94.54)
  Bottom Layer w0.203: v1(16.51,83.87) 48.64,83.87 v1(48.77,83.74) ; v1(34.16,39.8) 24.38,39.8 24.13,40.06 24.13,43.61 24.64,43.61 25.4,44.37 ; v1(48.51,47.3) 41.28,47.3 40.72,46.74 35.13,46.74 v1(34.54,46.15)
A_PIN_B: length 130.1
  Top Layer w0.203: v1(4.57,68.76) 4.27,69.06 4.27,88.01 4.7,88.44 ; v1(38.99,52.12) 38.99,45.52 39.24,45.26 39.24,43.36 39.57,43.03 39.57,40.61 40.73,39.46 40.73,30.62 v1(40.51,30.4) ; v1(6.22,68.76) 5.97,68.5 5.97,40.94 8.84,38.08 8.84,30.99 v1(8.76,30.91)
  Bottom Layer w0.203: v1(40.51,30.4) 9.27,30.4 v1(8.76,30.91) ; v1(6.22,68.76) v1(4.57,68.76) ; 53.59,52.12 v1(38.99,52.12) 38.86,51.99
A_PIN_F: length 111.2
  Top Layer w0.203: v1(49.66,11.1) 49.28,11.48 49.28,19.74 49.48,19.94 49.48,39.6 49.4,39.67 49.4,63.17 v1(49.15,63.42)
  Inner2 w0.203: 7.87,64.57 8.76,63.68 10.79,63.68 12.06,62.41 12.06,56.44 12.7,55.8 14.22,55.8 16.13,57.71 27.18,57.71 28.83,59.36 28.83,64.69 29.08,64.95 47.62,64.95 v1(49.15,63.42)
  Bottom Layer w0.203: 52.2,10.97 49.78,10.97 v1(49.66,11.1)
B_PIN_B: length 122
  Top Layer w0.203: v1(50.42,46.03) v1(50.42,49.58) ; 5.33,86.92 4.62,86.21 4.62,70.99 v1(4.83,70.79) ; v1(9.4,31.55) 9.35,31.6 9.35,38.2 6.27,41.28 6.27,67.67 7.11,68.5 7.11,68.83 6.55,69.39 6.35,69.39 5.97,69.77 v1(5.97,71.17) ; v1(40.13,31.17) 40.34,31.37 40.34,35.92 40.26,35.99 40.26,38.41 v1(40,38.66)
  Inner2 w0.203: v1(50.42,46.03) 49.66,45.26 49.66,40.18 v1(48.77,39.29)
  Bottom Layer w0.203: v1(5.97,71.17) 5.84,71.17 5.46,70.79 v1(4.83,70.79) ; v1(40,38.66) 40.21,38.86 48.84,38.86 48.9,38.91 48.9,39.17 v1(48.77,39.29) ; v1(9.4,31.55) 10.11,30.84 39.62,30.84 39.83,31.04 40.01,31.04 v1(40.13,31.17) ; v1(50.42,49.58) 53.47,49.58
B_PIN_F: length 112.2
  Top Layer w0.203: v1(49.78,76.5) 49.78,41.07 50.93,39.93 52.32,39.93 55.25,37.01 55.25,24.56 52.07,21.39 52.07,12.62 52.32,12.37
  Bottom Layer w0.203: v1(49.78,76.5) 41.53,76.5 40.16,77.88 22.83,77.88 22.17,77.22 18.47,77.22 17.7,77.98 13.77,77.98 13.22,78.53 8.62,78.53 8,77.9 7.87,77.9
BL_IPS: length 24
  Top Layer w0.254: 51.05,82.47 50.8,82.73 v1(50.8,90.86) ; 37.47,90.73 v1(37.47,92.13)
  Bottom Layer w0.254: v1(50.8,90.86) 50.5,91.16 46.69,91.16 45.41,92.45 37.79,92.45 v1(37.47,92.13)
BUZZER_PIN: length 4.8
  Top Layer w0.203: v1(33.02,44.5) 33.02,47.3 ; 31.24,47.68 33.02,47.68
  Bottom Layer w0.203: 32.89,44.37 v1(33.02,44.5)
CS_IPS: length 29.1
  Top Layer w0.254: 35.05,90.98 35.05,92.38 v1(35.18,92.51) ; v1(53.09,91.11) 53.09,82.86 U1.60 53.21,82.47
  Bottom Layer w0.254: v1(35.18,92.51) 35.48,92.8 45.55,92.8 46.84,91.52 52.68,91.52 v1(53.09,91.11)
D0_CAM: length 49
  Top Layer w0.203: v1(11.18,68.76) 11.16,68.77 11.16,89.6 v1(10.67,90.09)
  Top Layer w0.254: v1(28.45,89.59) 28.41,89.62 28.41,91.83 28.07,92.17 28.07,93.53 27.69,93.91 27.69,94.67
  Bottom Layer w0.203: v1(28.45,89.59) 11.18,89.59 v1(10.67,90.09) ; 7.62,67.87 7.62,68.12 8.25,68.76 v1(11.18,68.76)
D0_IPS: length 13.7
  Top Layer w0.203: v1(23.62,87.05) 23.62,86.08 24.4,85.31 24.4,80.81 25.27,79.93
  Top Layer w0.254: v1(19.56,86.67) 19.56,88.06 19.43,88.19
  Bottom Layer w0.254: v1(19.56,86.67) 20.03,87.14 23.53,87.14 v1(23.62,87.05)
D1_CAM: length 49.3
  Top Layer w0.203: v1(12.19,84) 11.47,83.28 11.47,70.62 11.67,70.42 11.67,69.02 11.88,68.82 11.88,68.41 11.08,67.61 10.79,67.61 10.54,67.36
  Top Layer w0.254: v1(30.61,84.89) 30.99,85.27 v1(30.99,91.62) ; 28.19,94.41 28.19,93.94 28.47,93.66 28.47,93.29 28.45,93.27 28.45,92.51 28.7,92.25 v1(28.83,92.25)
  Bottom Layer w0.203: v1(30.61,84.89) 30.15,84.43 15.57,84.43 15.37,84.23 15.37,84.12 14.99,83.74 14.89,83.74 14.64,83.49 14.35,83.49 13.39,84.45 12.65,84.45 v1(12.19,84)
  Bottom Layer w0.254: v1(30.99,91.62) 30.35,92.25 v1(28.83,92.25)
D1_IPS: length 8.5
  Top Layer w0.203: v1(25.15,86.03) 25.15,82.6
  Top Layer w0.254: v1(22.22,86.16) 22.1,86.28 22.1,88.19
  Bottom Layer w0.254: v1(25.15,86.03) 22.35,86.03 v1(22.22,86.16)
D2_CAM: length 53.9
  Top Layer w0.203: 7.24,69.77 7.11,69.9 6.82,69.9 6.55,70.17 6.55,85.19 v1(6.35,85.39) ; v1(18.16,94.54) 18.16,96.44 v1(19.3,97.59) ; v1(28.19,98.09) 28.83,97.46 28.83,94.67 ; v1(12.45,86.03) 12.52,86.11 12.52,90.65 v1(12.06,91.11)
  Inner2 w0.203: v1(19.3,97.59) 19.59,97.59 20.94,98.93 27.36,98.93 v1(28.19,98.09)
  Bottom Layer w0.203: v1(6.35,85.39) 6.98,86.03 v1(12.45,86.03) ; v1(12.06,91.11) 12.06,93.78 12.83,94.54 v1(18.16,94.54)
D2_IPS: length 11.6
  Top Layer w0.203: 22.48,80.44 21.59,81.33 21.59,83.24 21.34,83.49 v1(21.34,86.54)
  Top Layer w0.254: v1(24.51,86.67) 24.64,86.79 24.64,88.06
  Bottom Layer w0.254: v1(24.51,86.67) 24.26,86.41 22.99,86.41 22.62,86.78 21.58,86.78 v1(21.34,86.54)
D3_CAM: length 53.3
  Top Layer w0.203: v1(8.76,90.73) 8.71,90.68 8.71,80.53 9.16,80.09 9.16,70.4 9.65,69.9 U1.103 ; v1(17.27,95.17) 17.27,95.99 18.67,97.38 v1(18.67,98.35) ; v1(28.83,98.6) 29.34,98.09 29.34,94.67
  Inner2 w0.203: v1(18.67,98.35) 19.84,98.35 20.73,99.24 28.19,99.24 v1(28.83,98.6)
  Bottom Layer w0.203: v1(8.76,90.73) 8.43,91.06 8.43,94.18 9.1,94.84 16.94,94.84 v1(17.27,95.17)
D3_IPS: length 9.8
  Top Layer w0.203: U1.84 22.86,85.27 v1(22.99,85.39)
  Top Layer w0.254: 26.92,88.06 27.31,87.68 v1(27.31,85.65)
  Bottom Layer w0.203: v1(22.99,85.39) 27.05,85.39 v1(27.31,85.65)
D4_CAM: length 55.8
  Top Layer w0.203: v1(19.69,98.98) 15.24,98.98 14.99,98.73 14.86,98.73 14.66,98.93 11.48,98.93 11,98.45 11,95.76 10.64,95.4 6.68,95.4 6.48,95.19 v1(6.48,90.73) ; v1(5.72,84.38) 5.92,84.18 5.92,72.75 v1(5.97,72.69) ; 29.72,94.79 29.72,96.57 29.84,96.7 v1(29.84,98.73)
  Bottom Layer w0.203: v1(29.84,98.73) 28.98,99.6 20.3,99.6 v1(19.69,98.98) ; v1(5.97,72.69) 6.1,72.57 v1(7.49,72.57) ; v1(6.48,90.73) 6.48,86.41 5.72,85.65 v1(5.72,84.38)
D4_IPS: length 11.4
  Top Layer w0.254: 29.59,88.57 29.59,88.21 29.84,87.96 v1(29.84,87.05) ; U1.74 35.56,86.28 v1(35.31,86.54)
  Bottom Layer w0.254: v1(35.31,86.54) 35.23,86.46 30.43,86.46 v1(29.84,87.05)
D5_CAM: length 52.7
  Top Layer w0.203: v1(30.99,98.09) 30.99,97.84 30.61,97.46 30.61,96.32 30.23,95.94 30.23,94.54 ; v1(20.32,97.08) 19.54,97.08 18.72,96.26 18.72,93.73 20.83,91.62 20.83,86.92 20.57,86.67 20.57,85.39 19.18,84 19.18,76.38 19.43,76.12 19.43,72.57 v1(19.3,72.44)
  Inner1 w0.203: 10.41,72.57 10.79,72.19 16.1,72.19 16.1,72.44 v1(19.3,72.44)
  Inner2 w0.203: v1(20.32,97.08) 20.91,97.08 22.45,98.63 26.77,98.63 27.94,97.46 28.7,97.46 29.34,98.09 v1(30.99,98.09)
D5_IPS: length 8.5
  Top Layer w0.203: 32.64,79.81 31.99,80.46 31.99,87.29 32.26,87.55 32.26,87.94
D6_CAM: length 66.6
  Top Layer w0.203: v1(31.12,98.98) 31.62,98.48 31.62,97.94 30.99,97.3 30.99,95.9 30.73,95.65 30.73,94.92 ; v1(1.91,98.6) 0.4,97.1 0.4,76.23 v1(0.76,75.87)
  Inner1 w0.203: v1(31.12,98.98) 30.89,98.98 29.44,97.54 27.96,97.54 25.96,99.54 2.84,99.54 v1(1.91,98.6)
  Bottom Layer w0.203: v1(0.76,75.87) 1.78,74.85 7.75,74.85
D6_IPS: length 7.4
  Top Layer w0.254: 35.05,88.32 34.8,88.06 34.67,88.06 ; v1(33.02,87.05) 33.02,82.73
  Bottom Layer w0.254: v1(33.02,87.05) 33.02,87.17 34.16,88.32 35.05,88.32
D7_CAM: length 68.4
  Top Layer w0.203: v1(1.27,76.63) 1.17,76.63 0.71,77.1 0.71,96.61 2.31,98.22 v1(2.67,98.22) ; 32.13,98.98 32.7,98.98 33.19,98.5 33.19,97.22 31.24,95.27 31.24,94.92
  Inner2 w0.203: v1(2.67,98.22) 2.67,98.73 3.54,99.6 31.77,99.6 v1(32.26,99.11)
  Bottom Layer w0.203: 10.03,75.49 9,76.52 1.39,76.52 v1(1.27,76.63)
D7_IPS: length 15.6
  Top Layer w0.203: 30.1,80.19 30.1,80.31 29.45,80.96 29.45,85.38 v1(29.97,85.9)
  Top Layer w0.254: 37.59,87.94 37.59,86.28 v1(37.34,86.03)
  Bottom Layer w0.254: v1(29.97,85.9) 37.21,85.9 v1(37.34,86.03)
DIR_BRUSHED_MOTOR: length 30
  Top Layer w0.203: v1(47.62,47.93) v1(47.62,45.64) ; v1(37.59,48.06) 38.05,48.51 38.05,55.36 37.85,55.56 37.85,55.93 37.08,56.69 v1(37.08,58.22)
  Inner2 w0.203: 48.26,41.83 46.99,43.1 46.99,45.01 v1(47.62,45.64)
  Bottom Layer w0.203: 34.8,58.22 v1(37.08,58.22) ; v1(37.59,48.06) 47.5,48.06 v1(47.62,47.93)
DIR_ENCODER: length 34.4
  Top Layer w0.203: 1.4,62.53 2.92,64.06 2.92,80.31 3.43,80.82 3.43,80.89
  Bottom Layer w0.203: v1(3.3,80.7) 3.5,80.9 5.57,80.9 5.96,81.29 17.18,81.29 17.91,80.57
DIR_PIN_B: length 136
  Top Layer w0.203: v1(45.72,40.06) 45.59,39.93 45.59,25.96 v1(45.21,25.58) ; v1(2.54,91.36) 1.65,90.47 v1(1.65,77.78) ; v1(4.19,57.96) 5.28,56.87 5.28,40.69 8.1,37.87 8.1,32.66 6.92,31.49 6.93,31.48 6.93,25.76 v1(7.24,25.45) ; v1(1.65,73.33) 1.02,72.69 1.02,67.74 1.65,67.11 v1(1.65,66.98)
  Inner1 w0.203: v1(4.19,57.96) 4.19,58.34 6.1,60.25 6.1,66.47 5.84,66.73 1.91,66.73 v1(1.65,66.98)
  Inner2 w0.203: v1(1.65,73.33) 1.85,73.53 1.85,77.57 v1(1.65,77.78)
  Bottom Layer w0.203: 5.21,91.62 2.79,91.62 v1(2.54,91.36) ; v1(45.72,40.06) 45.97,40.31 50.55,40.31 50.67,40.44 50.67,41.71 ; v1(45.21,25.58) 45.09,25.45 v1(7.24,25.45)
DIR_PIN_F: length 41.7
  Top Layer w0.203: 48.01,44.37 47.12,43.48 47.12,41.71 47.29,41.53 47.29,36.96 48.08,36.17 48.08,32.13 47.5,31.55 v1(47.5,8.56)
  Bottom Layer w0.203: 52.2,8.18 47.88,8.18 v1(47.5,8.56)
DL1A_SCL: length 72.7
  Top Layer w0.203: v1(44.83,95.3) 44.7,95.17 44.7,82.14 44.32,81.76 44.32,47.14 43.84,46.66
  Inner1 w0.203: v1(44.83,95.3) 43.81,96.32 36.96,96.32 v1(34.29,98.98)
  Bottom Layer w0.203: 45.85,41.83 46.86,42.85 46.86,45.52 45.72,46.66 v1(43.81,46.66) ; 32.51,95.81 32.51,96.18 34.29,97.95 v1(34.29,98.98)
DL1A_SCL_2: length 32.5
  Top Layer w0.203: v1(37.47,98.35) 38.1,97.71 38.1,91.87 39.1,90.87 39.1,81.6 v1(39.12,81.58)
  Bottom Layer w0.203: v1(37.47,98.35) 36.67,98.35 35.95,97.62 35.95,96.32 35.69,96.06 ; 27.94,82.47 28.07,82.47 28.96,81.58 v1(39.12,81.58)
DL1A_SDA: length 73
  Top Layer w0.203: v1(40.89,46.15) 40.77,46.28 40.77,47.8 40.39,48.18 40.39,55.68 42.11,57.4 42.11,96.27 43.43,97.59 43.43,99.11 43.23,99.31 35.51,99.31 v1(35.31,99.11)
  Bottom Layer w0.203: v1(40.89,46.15) 41.15,45.9 45.64,45.9 45.85,45.69 45.85,44.75 ; v1(35.31,99.11) 35.31,98.48 33.91,97.08 33.91,96.19 33.4,95.68
DL1A_SDA_2: length 35.1
  Top Layer w0.203: v1(28.7,77.14) 27.94,77.9 27.94,79.68 ; v1(36.83,76.89) 37.1,77.15 37.1,85.48 36.24,86.34 36.24,91.33 36.91,92 36.91,97.64 v1(36.83,97.71)
  Bottom Layer w0.203: v1(28.7,77.14) 29.13,77.57 35.54,77.57 36.23,76.89 v1(36.83,76.89) ; v1(36.83,97.71) 36.58,97.46 36.58,95.81
DL1A_XSHUT: length 65.7
  Top Layer w0.203: v1(36.07,98.6) 36.37,98.91 37.79,98.91 38.48,98.22 38.48,92.25 39.6,91.13 39.6,81.86 39.75,81.71 39.75,80.7 39.55,80.49 39.55,44.18 39.88,43.85 39.88,43.23 v1(40.13,43.23)
  Bottom Layer w0.203: v1(40.13,43.23) 42.29,43.23 43.18,42.34 ; 34.54,95.81 34.95,96.21 34.95,97.48 v1(36.07,98.6)
DL1A_XSHUT_2: length 26.7
  Top Layer w0.203: 45.97,80.06 46.72,80.81 46.72,83.25 46.1,83.87 46.1,95.17 v1(45.72,95.56)
  Inner1 w0.203: v1(45.72,95.56) 44.32,96.95 v1(37.47,96.95)
  Bottom Layer w0.203: 37.47,95.3 v1(37.47,96.95)
KEY_1: length 68.1
  Top Layer w0.203: v1(3.17,30.15) 2.41,30.91 2.41,36.37 v1(2.79,36.75) ; v1(38.99,37.39) 39.1,37.5 39.1,42.61 38.48,43.23 38.48,44.25 ; v1(7.62,29.9) 7.87,29.64 7.87,19.35 6.73,18.21
  Bottom Layer w0.203: v1(38.99,37.39) 38.81,37.21 35.99,37.21 35.31,37.9 3.94,37.9 v1(2.79,36.75) ; v1(7.62,29.9) 3.43,29.9 v1(3.17,30.15)
KEY_2: length 61.9
  Top Layer w0.203: v1(4.57,27.36) 4.99,26.94 4.99,19.83 4.52,19.35 3.94,19.35 ; 37.97,41.83 37.97,38.91 v1(37.72,38.66) ; v1(1.91,38.15) 1.7,37.95 1.7,27.56 v1(1.91,27.36)
  Bottom Layer w0.203: v1(37.72,38.66) 37.59,38.53 2.29,38.53 v1(1.91,38.15) ; v1(1.91,27.36) v1(4.57,27.36)
KEY_3: length 62.3
  Top Layer w0.203: v1(36.58,37.77) 36.58,43.74 35.94,44.37 ; v1(6.1,29.13) 6.48,28.75 6.48,20.62 ; v1(2.41,29.51) 2.01,29.92 2.01,37.02 2.63,37.64 v1(2.67,37.64)
  Bottom Layer w0.203: v1(2.41,29.51) 2.79,29.13 v1(6.1,29.13) ; v1(2.67,37.64) 3.25,38.23 36.12,38.23 v1(36.58,37.77)
KEY_4: length 56
  Top Layer w0.203: v1(1.14,28.63) 1.14,38.41 v1(1.65,38.91) ; 35.43,41.58 35.43,39.55 v1(35.56,39.42) ; v1(3.81,28.25) 3.81,21.9
  Bottom Layer w0.203: v1(1.14,28.63) 3.43,28.63 v1(3.81,28.25) ; v1(1.65,38.91) 35.05,38.91 v1(35.56,39.42)
KEY_5: length 54
  Top Layer w0.203: v1(53.47,69.77) 54.37,68.87 54.37,39.22 56.29,37.3 56.29,19.9 54.36,17.96 54.1,17.96
KEY_6: length 61.2
  Top Layer w0.203: v1(50.55,16.94) 50.55,19.23 50.67,19.35 ; v1(54.61,16.81) 56.6,18.8 56.6,37.42 54.68,39.35 54.68,68.7 55.5,69.52
  Bottom Layer w0.203: v1(54.61,16.81) 50.67,16.81 v1(50.55,16.94)
KEY_7: length 54.4
  Top Layer w0.203: 53.09,72.19 52.32,71.42 52.32,40.83 55.96,37.2 55.96,23.12 53.47,20.62
KEY_8: length 62.2
  Top Layer w0.203: v1(55.12,23.29) 55.25,23.29 55.66,23.7 55.66,37.07 52.02,40.71 52.02,40.87 51.94,40.94 v1(51.94,73.58)
  Bottom Layer w0.203: v1(51.94,73.58) 55.12,73.58 v1(56.01,72.69) ; v1(50.04,21.9) 53.72,21.9 v1(55.12,23.29)
LSB_ENCODER: length 34.7
  Top Layer w0.203: 4.32,62.53 5.41,63.63 5.41,81.38 v1(5.33,81.46)
  Bottom Layer w0.203: 20.19,80.57 19.16,81.6 5.47,81.6 v1(5.33,81.46)
PCLK_CAM: length 24.8
  Top Layer w0.254: 24.26,94.67 24.26,94.03 v1(23.88,93.65) ; 13.08,80.19 13.73,80.84 13.73,93.28 v1(14.1,93.65)
  Bottom Layer w0.254: v1(23.88,93.65) v1(14.1,93.65)
PWM1: length 10.8
  Bottom Layer w0.254: 40.13,57.58 37.47,57.58 36.19,56.31 34.54,56.31 31.88,53.64 30.99,53.64
PWM2: length 13.7
  Bottom Layer w0.254: 40,58.85 39.32,58.85 39.01,59.16 39.01,59.85 38.99,59.87 38.99,63.3 36.96,65.33 33.53,65.33 33.02,64.82 31.62,64.82
PWM_BRUSHED_MOTOR: length 37.5
  Top Layer w0.203: v1(32.77,56.82) 32.77,53.39 32.89,53.26 v1(32.89,48.56)
  Inner2 w0.203: v1(55.37,48.31) 54.86,47.8 54.86,45.39 55.63,44.63
  Bottom Layer w0.203: v1(55.37,48.31) 50.29,48.31 49.91,48.69 33.02,48.69 v1(32.89,48.56) ; 35.05,56.82 v1(32.77,56.82)
PWM_PIN_B: length 115.9
  Top Layer w0.203: v1(37.59,35.36) 37.97,35.74 v1(37.97,37.9) ; 4.95,92.89 4.57,92.89 3.94,92.25 3.94,80.19 3.56,79.81 v1(3.56,73.08) ; v1(9.91,36.63) 9.91,39.8 8.76,40.94 8.76,73.46 8.51,73.71 v1(8.38,73.71)
  Bottom Layer w0.203: v1(8.38,73.71) 3.56,73.71 v1(3.56,73.08) ; v1(37.59,35.36) 37.21,35.36 36.37,36.19 10.34,36.19 v1(9.91,36.63) ; v1(37.97,37.9) 41.02,40.94 46.48,40.94 47.24,41.71 47.24,42.72 47.75,43.23 54.1,43.23 55.5,41.83 v1(55.75,41.83)
PWM_PIN_F: length 57.7
  Top Layer w0.203: v1(44.07,29.9) 43.94,29.77 v1(43.94,7.04) ; v1(53.21,37.9) 53.21,37.72 54.94,35.99 54.94,30.86 v1(53.97,29.9)
  Inner1 w0.203: v1(53.21,37.9) 53.21,40.06 54.48,41.33 54.48,43.36 53.59,44.25
  Bottom Layer w0.203: v1(43.94,7.04) 44.32,6.66 52.32,6.66 ; v1(44.07,29.9) v1(53.97,29.9)
RDV_IPS: length 41.8
  Top Layer w0.254: v1(24.76,93.52) 24.76,91.11 25.02,90.86 ; v1(48.51,94.16) 49.77,92.9 49.77,80.96 50.67,80.06
  Bottom Layer w0.254: v1(48.51,94.16) 48.45,94.23 25.47,94.23 v1(24.76,93.52)
RS_IPS: length 38.2
  Top Layer w0.254: v1(51.94,92.63) 52.31,92.27 52.31,80.58 52.96,79.93 ; v1(29.46,93.02) 29.46,91.11
  Bottom Layer w0.254: v1(29.46,93.02) 29.46,93.22 29.75,93.52 45.85,93.52 46.55,92.81 51.64,92.81 51.82,92.63 v1(51.94,92.63)
RST_IPS: length 35.2
  Top Layer w0.254: v1(55.75,91.87) 55.88,91.75 55.88,82.86 ; v1(32.26,92.89) 32.13,92.76 32.13,90.98
  Bottom Layer w0.254: v1(32.26,92.89) 32.53,93.16 45.7,93.16 46.48,92.38 50.16,92.38 50.42,92.13 51.65,92.13 51.91,91.87 v1(55.75,91.87)
RXD_CAM: length 27.1
  Top Layer w0.254: v1(26.03,92.38) 26.29,92.63 26.29,93.4 25.78,93.9 25.78,94.67 ; v1(14.73,85.01) 14.58,85.01 14.45,85.14 14.45,91.72 v1(14.86,92.13) ; 12.83,82.47 U1.92 12.95,82.86 v1(12.95,85.39)
  Bottom Layer w0.254: v1(26.03,92.38) 25.88,92.53 23.09,92.53 22.68,92.94 15.54,92.94 14.86,92.25 v1(14.86,92.13) ; v1(14.73,85.01) 14.1,85.65 13.21,85.65 v1(12.95,85.39)
SCL_INA: length 128
  Top Layer w0.203: 9.53,94.41 10.67,94.41 11.18,94.92 ; v1(44.83,37.14) 44.83,39.8 44.63,40 44.63,81.64 45.34,82.35 ; v1(48.26,37.01) 48.39,36.88 48.39,7.04 ; v1(45.47,85.27) 45.47,82.73 45.59,82.6 ; 11.3,94.79 12.06,94.03 12.06,91.9 12.83,91.14 12.83,86.92 v1(13.08,86.67) ; 48.39,6.4 48.01,6.78 46.86,6.78
  Bottom Layer w0.203: v1(13.08,86.67) 13.97,86.67 14.66,85.98 21.61,85.98 22.86,84.73 29.71,84.73 30.1,85.12 30.1,85.27 30.25,85.42 30.43,85.42 30.59,85.57 37.02,85.57 37.22,85.37 45.37,85.37 v1(45.47,85.27) ; v1(48.26,37.01) 48.13,37.14 v1(44.83,37.14)
SDA_INA: length 177.3
  Top Layer w0.203: 48.9,5.89 48.9,5.51 48.64,5.26 47.12,5.26 46.99,5.38 ; v1(43.56,38.15) 43.43,38.02 v1(43.43,36.5) ; v1(11.68,37.01) 11.56,37.14 11.56,67.36 12.32,68.12 12.32,70.92 11.94,71.3 12.19,71.55 v1(12.19,77.78) ; v1(11.81,85.39) 11.56,85.65 11.56,90.35 11.3,90.6 11.3,93.02 ; 48.9,6.53 48.82,6.6 48.82,38.08 v1(48.9,38.15) ; v1(46.74,78.66) 46.74,40.94 46.61,40.82 v1(46.61,38.15) ; 9.02,93.9 9.02,93.52 9.27,93.27 11.18,93.27
  Inner1 w0.203: v1(11.81,85.39) 11.43,85.01 11.43,78.54 v1(12.19,77.78)
  Bottom Layer w0.203: v1(46.74,78.66) 46.35,79.05 44.07,79.05 43.69,79.43 43.69,79.68 ; v1(43.56,38.15) v1(46.61,38.15) v1(48.9,38.15) ; v1(43.43,36.5) 12.19,36.5 v1(11.68,37.01)
STEERING_1: length 114.4
  Top Layer w0.203: 9.65,88.7 9.4,88.44 v1(9.4,85.27) ; v1(2.54,84.76) v1(2.54,82.09) ; v1(10.16,31.93) 10.92,32.69 10.92,40.69 11.25,41.02 11.25,65.76 v1(10.92,66.09)
  Inner1 w0.203: v1(3.68,68.12) 3.68,71.68 2.54,72.82 v1(2.54,82.09)
  Inner2 w0.203: v1(3.68,68.12) 3.68,67.36 4.95,66.09 v1(10.92,66.09) ; v1(37.08,33.96) 37.34,34.21 40,34.21 40.39,34.59 40.39,35.99 41.78,37.39 41.78,42.72 40.89,43.61 40.89,44.5
  Bottom Layer w0.203: v1(9.4,85.27) 8.13,85.27 6.48,83.62 5.33,83.62 4.19,84.76 v1(2.54,84.76) ; v1(37.08,33.96) 34.67,31.55 10.54,31.55 v1(10.16,31.93)
STOP_PIN_B: length 129.5
  Top Layer w0.203: v1(8,31.42) 8.53,31.95 8.53,37.87 5.59,40.82 5.59,57.58 v1(4.95,58.22) ; v1(1.78,68) 2.41,68.63 2.41,80.82 3.43,81.84 3.43,92.51 5.33,94.41 ; v1(50.29,29.26) 49.91,29.64 49.91,30.78 v1(50.29,31.17)
  Inner1 w0.203: v1(51.05,36.88) 49.53,35.36 49.53,32.69 50.29,31.93 v1(50.29,31.17) ; v1(4.7,67.36) 6.1,67.36 6.62,66.84 6.62,59.41 5.42,58.22 v1(4.95,58.22)
  Bottom Layer w0.203: v1(4.7,67.36) 2.41,67.36 v1(1.78,68) ; v1(8,31.42) 8,30.78 8.51,30.28 8.97,30.28 9.14,30.1 32.77,30.1 33.1,29.77 42.8,29.77 43.31,29.26 v1(50.29,29.26) ; v1(51.05,36.88) 53.34,39.17 53.34,41.71
STOP_PIN_F: length 60.7
  Top Layer w0.203: v1(53.34,28.63) 53.26,28.7 53.26,30.33 54.63,31.7 54.63,34.98 51.05,38.56 51.05,38.91 ; v1(43.18,6.02) v1(43.18,28.5)
  Inner1 w0.203: 51.05,44.37 52.07,43.36 52.07,40.06 v1(51.05,39.04)
  Bottom Layer w0.203: v1(43.18,6.02) 43.94,5.26 v1(52.32,5.26) ; v1(53.34,28.63) 53.21,28.5 v1(43.18,28.5)
TXD_CAM: length 32.6
  Top Layer w0.254: v1(14.6,93.02) 14.1,92.51 14.1,84.76 v1(14.6,84.25) ; v1(9.27,84) 9.13,83.86 9.13,80.58 9.78,79.93 ; 25.27,94.67 25.27,93.9 25.65,93.52 v1(25.65,93.14)
  Bottom Layer w0.254: v1(9.27,84) 10.08,84.81 14.05,84.81 v1(14.6,84.25) ; v1(25.65,93.14) 25.4,92.89 23.24,92.89 22.84,93.29 14.88,93.29 v1(14.6,93.02)
V_OUT_BDC_B: length 1.6
  Top Layer w0.203: v1(7.87,97.33) 7.87,97.08 8,97.21 8,98.35
V_OUT_BDC_F: length 4.5
  Top Layer w0.203: 49.91,2.34 49.91,0.94 50.04,0.81 51.69,0.81 52.2,1.32 52.2,1.83
VSY_CAM: length 24
  Top Layer w0.254: 15.49,82.86 15.49,91.11 v1(15.24,91.36) ; 26.8,94.67 26.8,93.65 26.67,93.52 26.67,92 26.29,91.62 v1(25.91,91.62)
  Bottom Layer w0.254: v1(15.24,91.36) 15.24,91.62 16.2,92.58 22.54,92.58 22.94,92.18 24.7,92.18 24.85,92.02 25.5,92.02 v1(25.91,91.62)
WR_IPS: length 36.6
  Top Layer w0.254: v1(47.24,93.4) 47.23,93.38 47.23,80.71 47.75,80.19 ; v1(27.31,93.14) 27.31,90.98
  Bottom Layer w0.254: v1(47.24,93.4) 47.24,93.67 47.04,93.87 27.35,93.87 27.31,93.82 v1(27.31,93.14)
$1N3822: length 1.8
  Top Layer w0.254: 27.31,64.95 27.69,65.33 27.69,66.6
$1N3823: length 1.7
  Top Layer w0.203: 25.65,62.92 27.31,62.92
$1N3825: length 1.7
  Top Layer w0.254: 27.69,69.27 27.69,70.28 27.18,70.79
$1N4452: length 1.8
  Top Layer w0.254: 17.02,66.09 17.02,64.69 17.27,64.44
$1N4462: length 2.3
  Top Layer w0.254: 16.64,71.04 17.02,70.66 17.02,68.89
$1N5768: length 27.5
  Top Layer w0.203: v1(36.58,45.9) 36.96,46.28 36.96,54.66 36.7,54.92 ; v1(22.99,46.15) 23.24,46.15 24.64,47.55 26.03,47.55
  Inner2 w0.203: v1(36.58,45.9) 36.27,45.59 30.66,45.59 29.34,46.91 23.95,46.91 23.19,46.15 v1(22.99,46.15)
$1N5769: length 14.1
  Top Layer w0.203: v1(41.66,53.9) 41.66,55.17 ; v1(33.66,54.03) 33.66,49.2
  Bottom Layer w0.203: v1(33.66,54.03) 41.53,54.03 v1(41.66,53.9)
$1N14459: length 2.2
  Bottom Layer w0.254: 29.46,47.17 28.45,48.18 27.69,48.18
$1N14461: length 3.5
  Bottom Layer w0.254: 29.46,48.69 28.7,49.45 27.69,49.45 ; 29.72,50.34 29.72,49.07 29.59,48.95
$1N14462: length 1.7
  Bottom Layer w0.254: 29.46,51.99 27.81,51.99
$1N14464: length 1.6
  Bottom Layer w0.254: 28.07,53.39 29.34,53.39 29.59,53.64
$1N14466: length 2.8
  Bottom Layer w0.254: 30.1,58.6 29.08,58.6 28.57,59.11 27.56,59.11
$1N14468: length 4.3
  Bottom Layer w0.254: 29.84,61.9 29.84,60.25 29.97,60.12 28.07,60.12 27.69,60.5
$1N14469: length 2
  Bottom Layer w0.254: 28.32,63.04 28.83,63.55 30.1,63.55
$1N14471: length 1.7
  Bottom Layer w0.254: 28.32,64.44 28.83,64.95 29.84,64.95
$1N14482: length 7.1
  Bottom Layer w0.7: 25.53,61.52 19.18,61.52 18.67,62.03
$1N14483: length 6.9
  Bottom Layer w0.7: 26.16,50.85 19.3,50.85
$1N15502: length 1.7
  Top Layer w0.203: 5.72,5.13 4.06,5.13
$1N15505: length 1.8
  Top Layer w0.203: 5.97,1.7 4.19,1.7
$1N15508: length 1.7
  Top Layer w0.203: 12.19,8.31 13.84,8.31
$1N15805: length 2
  Top Layer w0.203: 13.84,5.13 12.19,5.13 11.94,4.88
$1N15808: length 2
  Top Layer w0.203: 5.97,8.43 5.84,8.56 4.06,8.56
$1N22497: length 43.5
  Top Layer w0.203: v1(51.56,89.84) 51.36,90.04 51.36,96.77 v1(51.05,97.08)
  Inner1 w0.203: v1(26.54,96.44) 33.94,96.44 35.59,94.79 42.9,94.79 45.06,92.63 50.55,92.63 51.56,91.62 v1(51.56,89.84)
  Bottom Layer w0.203: v1(51.05,97.08) 50.16,97.97 45.09,97.97 44.45,97.33

## Copper pours and planes (outline as drawn; the poured copper is in the pictures)
3.3V_LDO_CAMERA on Top Layer: 15.75,55.3 15.75,26.59 20.45,26.59 20.45,53.01 18.16,55.3
3.3V_LDO_ELE on Top Layer: 20.7,55.3 20.7,26.59 23.37,26.59 23.37,54.92 22.99,55.3
3.3V_LDO_ENCODER on Top Layer: 25.78,55.17 25.78,53.14 23.75,51.11 23.75,26.72 29.08,26.72 29.08,54.03 27.94,55.17
5V_DCDC on Top Layer: 27.43,78.03 27.43,71.68 25.4,69.65 23.62,69.65 23.37,69.9 23.37,78.03
5V_DCDC on Top Layer: 18.54,60.63 22.1,60.63 22.22,60.5 22.22,58.85 17.65,58.85 17.53,58.98 17.53,59.61
5V_DCDC on Top Layer: 26.03,57.58 26.03,58.34 25.78,58.6 23.24,58.6 23.11,58.72 23.11,60.25 23.37,60.5 26.92,60.5 27.31,60.12 27.31,57.71 27.18,57.58
5V_DCDC on Top Layer: 21.08,60.5 23.5,60.5 23.5,57.58 21.08,57.58
5V_DCDC on Top Layer: 21.08,57.71 21.08,57.33 20.96,57.33 20.57,56.95 20.57,55.8 20.7,55.68 24.38,55.68 24.51,55.8 24.51,56.95 24.38,57.07 24.38,58.47 23.81,59.04 22.48,57.71
5V_DCDC on Top Layer: 21.84,59.74 24.76,59.74 24.89,59.61 24.89,65.84 21.97,65.84 21.84,65.71
5V_DCDC on Top Layer: 16,57.45 19.05,57.45 19.43,57.07 19.43,55.42 15.88,55.42 15.62,55.68 15.62,57.07
5V_DCDC on Top Layer: 16.26,60.5 18.8,60.5 18.8,55.68 16.26,55.68
5V_DCDC on Top Layer: 24.76,65.46 24.76,62.15 23.75,62.15 23.5,62.41 23.5,65.33 23.62,65.46
5V_DCDC on Inner2: 23.37,78.03 27.81,78.03 28.32,77.52 28.32,59.36 26.54,57.58 15.24,57.58 13.59,59.23 13.59,77.39 14.35,78.16 23.24,78.16
6.1V_DCDC on Top Layer: 6.35,90.09 6.35,88.19 6.48,88.06 8.25,88.06 8.25,90.22 6.48,90.22
6.1V_DCDC on Top Layer: 14.48,64.95 14.48,61.77 14.22,61.52 13.34,61.52 12.95,61.9 12.95,64.82 13.08,64.95
6.1V_DCDC on Top Layer: 16.76,77.9 16.76,71.17 15.11,69.52 12.7,69.52 12.45,69.77 12.45,77.78 12.57,77.9
